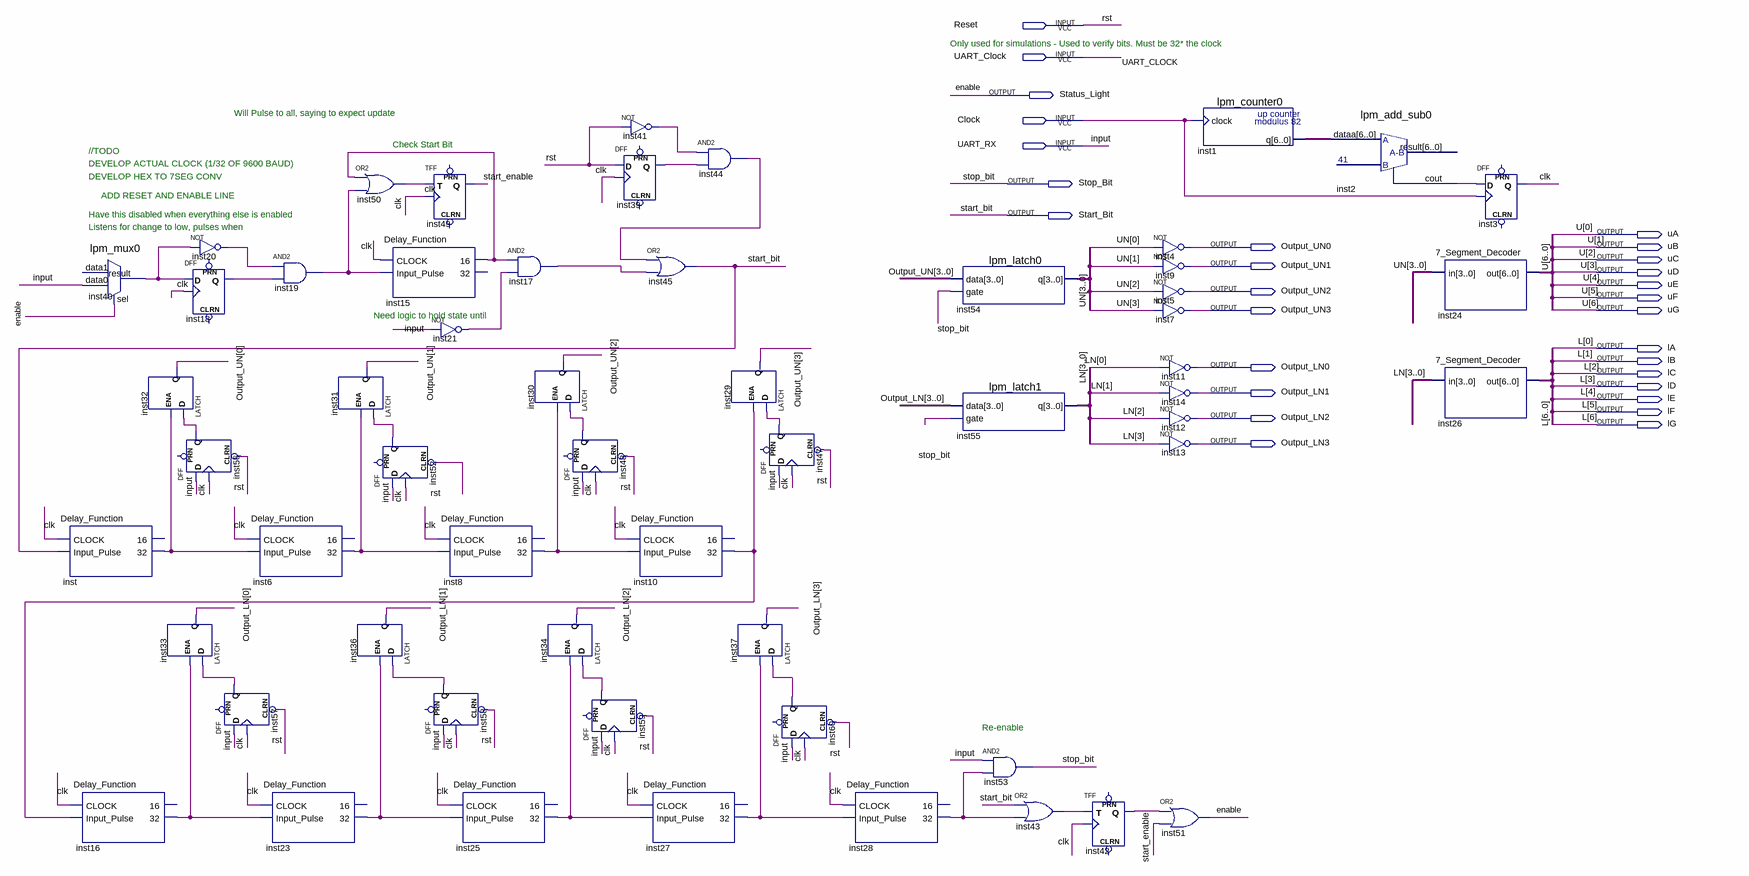
[diagram p0: schematic sheet]
// Quartus schematic design4TJN.bdf as structural Verilog: 57 symbols, 29 pins
module design4TJN (
  input  Reset,
  input  UART_Clock,
  input  Clock,
  input  UART_RX,
  output Status_Light,
  output Stop_Bit,
  output Start_Bit,
  output uA,
  output Output_UN0,
  output uB,
  output uC,
  output Output_UN1,
  output uD,
  output uE,
  output Output_UN2,
  output uF,
  output Output_UN3,
  output uG,
  output lA,
  output lB,
  output Output_LN0,
  output lC,
  output lD,
  output Output_LN1,
  output lE,
  output lF,
  output Output_LN2,
  output lG,
  output Output_LN3
);

  wire clk, inst2_cout, inst6_32, inst8_32, inst10_32, inst15_16, inst16_32, inst17_out, inst18_q,
       inst19_out, inst20_out, inst21_out, inst23_32, inst25_32, inst27_32, inst28_32, inst39_q,
       inst40_result, inst41_out, inst42_q, inst43_out, inst44_out, inst47_q, inst48_q, inst50_out, inst52_q,
       inst56_q, inst57_q, inst58_q, inst59_q, inst60_q, inst_32, start_enable;
  wire [3:0] LN, UN;
  wire [6:0] inst1_q;

  lpm_mux0 inst40 (.data0(UART_RX), .sel(Status_Light), .result(inst40_result));  // open: data1
  Delay_Function inst (.CLOCK(clk), .Input_Pulse(Start_Bit), .\32 (inst_32));  // open: 16
  Delay_Function inst16 (.CLOCK(clk), .Input_Pulse(inst10_32), .\32 (inst16_32));  // open: 16
  DFF inst18 (.CLK(clk), .D(inst40_result), .Q(inst18_q));  // open: CLRN, PRN
  LATCH inst32 (.D(inst56_q), .ENA(inst_32), .Q(Output_UN0));
  DFF inst56 (.CLRN(Reset), .CLK(clk), .D(UART_RX), .Q(inst56_q));  // open: PRN
  LATCH inst33 (.D(inst57_q), .ENA(inst16_32), .Q(Output_LN0));
  not inst20 (inst20_out, inst40_result);
  DFF inst57 (.CLRN(Reset), .CLK(clk), .D(UART_RX), .Q(inst57_q));  // open: PRN
  and inst19 (inst19_out, inst20_out, inst18_q);
  Delay_Function inst6 (.CLOCK(clk), .Input_Pulse(inst_32), .\32 (inst6_32));  // open: 16
  Delay_Function inst23 (.CLOCK(clk), .Input_Pulse(inst16_32), .\32 (inst23_32));  // open: 16
  LATCH inst31 (.D(inst52_q), .ENA(inst6_32), .Q(Output_UN1));
  or inst50 (inst50_out, inst15_16, inst19_out);
  Delay_Function inst15 (.CLOCK(clk), .Input_Pulse(inst19_out), .\16 (inst15_16));  // open: 32
  DFF inst52 (.CLRN(Reset), .CLK(clk), .D(UART_RX), .Q(inst52_q));  // open: PRN
  LATCH inst36 (.D(inst58_q), .ENA(inst23_32), .Q(Output_LN1));
  TFF inst49 (.T(inst50_out), .CLK(clk), .Q(start_enable));  // open: PRN, CLRN
  not inst21 (inst21_out, UART_RX);
  Delay_Function inst8 (.CLOCK(clk), .Input_Pulse(inst6_32), .\32 (inst8_32));  // open: 16
  DFF inst58 (.CLRN(Reset), .CLK(clk), .D(UART_RX), .Q(inst58_q));  // open: PRN
  Delay_Function inst25 (.CLOCK(clk), .Input_Pulse(inst23_32), .\32 (inst25_32));  // open: 16
  and inst17 (inst17_out, inst15_16, inst21_out);
  LATCH inst30 (.D(inst48_q), .ENA(inst8_32), .Q(Output_UN2));
  LATCH inst34 (.D(inst59_q), .ENA(inst25_32), .Q(Output_LN2));
  DFF inst48 (.CLRN(Reset), .CLK(clk), .D(UART_RX), .Q(inst48_q));  // open: PRN
  DFF inst59 (.CLRN(Reset), .CLK(clk), .D(UART_RX), .Q(inst59_q));  // open: PRN
  not inst41 (inst41_out, Reset);
  DFF inst39 (.CLK(clk), .D(Reset), .Q(inst39_q));  // open: CLRN, PRN
  Delay_Function inst10 (.CLOCK(clk), .Input_Pulse(inst8_32), .\32 (inst10_32));  // open: 16
  Delay_Function inst27 (.CLOCK(clk), .Input_Pulse(inst25_32), .\32 (inst27_32));  // open: 16
  or inst45 (Start_Bit, inst44_out, inst17_out);
  and inst44 (inst44_out, inst41_out, inst39_q);
  LATCH inst29 (.D(inst47_q), .ENA(inst10_32), .Q(Output_UN3));
  LATCH inst37 (.D(inst60_q), .ENA(inst27_32), .Q(Output_LN3));
  DFF inst47 (.CLRN(Reset), .CLK(clk), .D(UART_RX), .Q(inst47_q));  // open: PRN
  DFF inst60 (.CLRN(Reset), .CLK(clk), .D(UART_RX), .Q(inst60_q));  // open: PRN
  Delay_Function inst28 (.CLOCK(clk), .Input_Pulse(inst27_32), .\32 (inst28_32));  // open: 16
  lpm_latch0 inst54 (.data({Output_UN3, Output_UN2, Output_UN1, Output_UN0}), .gate(Stop_Bit), .q(UN));
  lpm_latch1 inst55 (.data({Output_LN3, Output_LN2, Output_LN1, Output_LN0}), .gate(Stop_Bit), .q(LN));
  and inst53 (Stop_Bit, UART_RX, inst28_32);
  or inst43 (inst43_out, Start_Bit, inst28_32);
  TFF inst42 (.T(inst43_out), .CLK(clk), .Q(inst42_q));  // open: PRN, CLRN
  lpm_counter0 inst1 (.clock(Clock), .q(inst1_q));
  not inst4 (Output_UN0, UN[0]);
  not inst9 (Output_UN1, UN[1]);
  not inst5 (Output_UN2, UN[2]);
  not inst7 (Output_UN3, UN[3]);
  not inst11 (Output_LN0, LN[0]);
  not inst14 (Output_LN1, LN[1]);
  not inst12 (Output_LN2, LN[2]);
  not inst13 (Output_LN3, LN[3]);
  or inst51 (Status_Light, inst42_q, start_enable);
  lpm_add_sub0 inst2 (.dataa(inst1_q), .cout(inst2_cout));  // open: result
  \7_Segment_Decoder  inst24 (.in(UN), .out({uG, uF, uE, uD, uC, uB, uA}));
  \7_Segment_Decoder  inst26 (.in(LN), .out({lG, lF, lE, lD, lC, lB, lA}));
  DFF inst3 (.CLK(Clock), .D(inst2_cout), .Q(clk));  // open: CLRN, PRN

  // Other names for the same wires on the sheet: enable = Status_Light; input = UART_RX;
  //   L[6:0] = {lG, lF, lE, lD, lC, lB, lA}; rst = Reset; U[6:0] = {uG, uF, uE, uD, uC, uB, uA}

  // Notes on the sheet:
  //   Only used for simulations - Used to verify bits. Must be 32* the clock
  //   Will Pulse to all, saying to expect update
  //   Check Start Bit
  //   //TODO
  //   DEVELOP ACTUAL CLOCK (1/32 OF 9600 BAUD)
  //   DEVELOP HEX TO 7SEG CONV
  //   ADD RESET AND ENABLE LINE
  //   Have this disabled when everything else is enabled
  //   Listens for change to low, pulses when
  //   Need logic to hold state until
  //   Re-enable
endmodule
